# Altium project RK_NVR_DEMO1_RK3588_LP4XD200P232SD8_V21_20211228.PrjPcb (part 6 of 19)

## Sheet 21.Power-PMIC_RK806-1.SchDoc
size 594 x 420 mm; Revision: V2.1; Schematic Page Number: 11; Page Number: 21; Check: Default; Schematic Name: RK_NVR_DEMO1_RK3588_LP4/4x_V21; Page Count: 43; Page name: 21.Power-PMIC_RK806-1; Designer: Zhangdz; Schematic Page Count: 99; Revcode: V2.1; DsnPath: E:\Work\SBER\RK3588_SOM\temp\RK_NVR_DEMO1_RK3588_LP4XD200P232SD8_V21_20211228.DSN; SchematicName: RK_NVR_DEMO1_RK3588_LP4/4x_V21; PageName: 21.Power-PMIC_RK806-1; PageSize: A2; TopSchematic: True
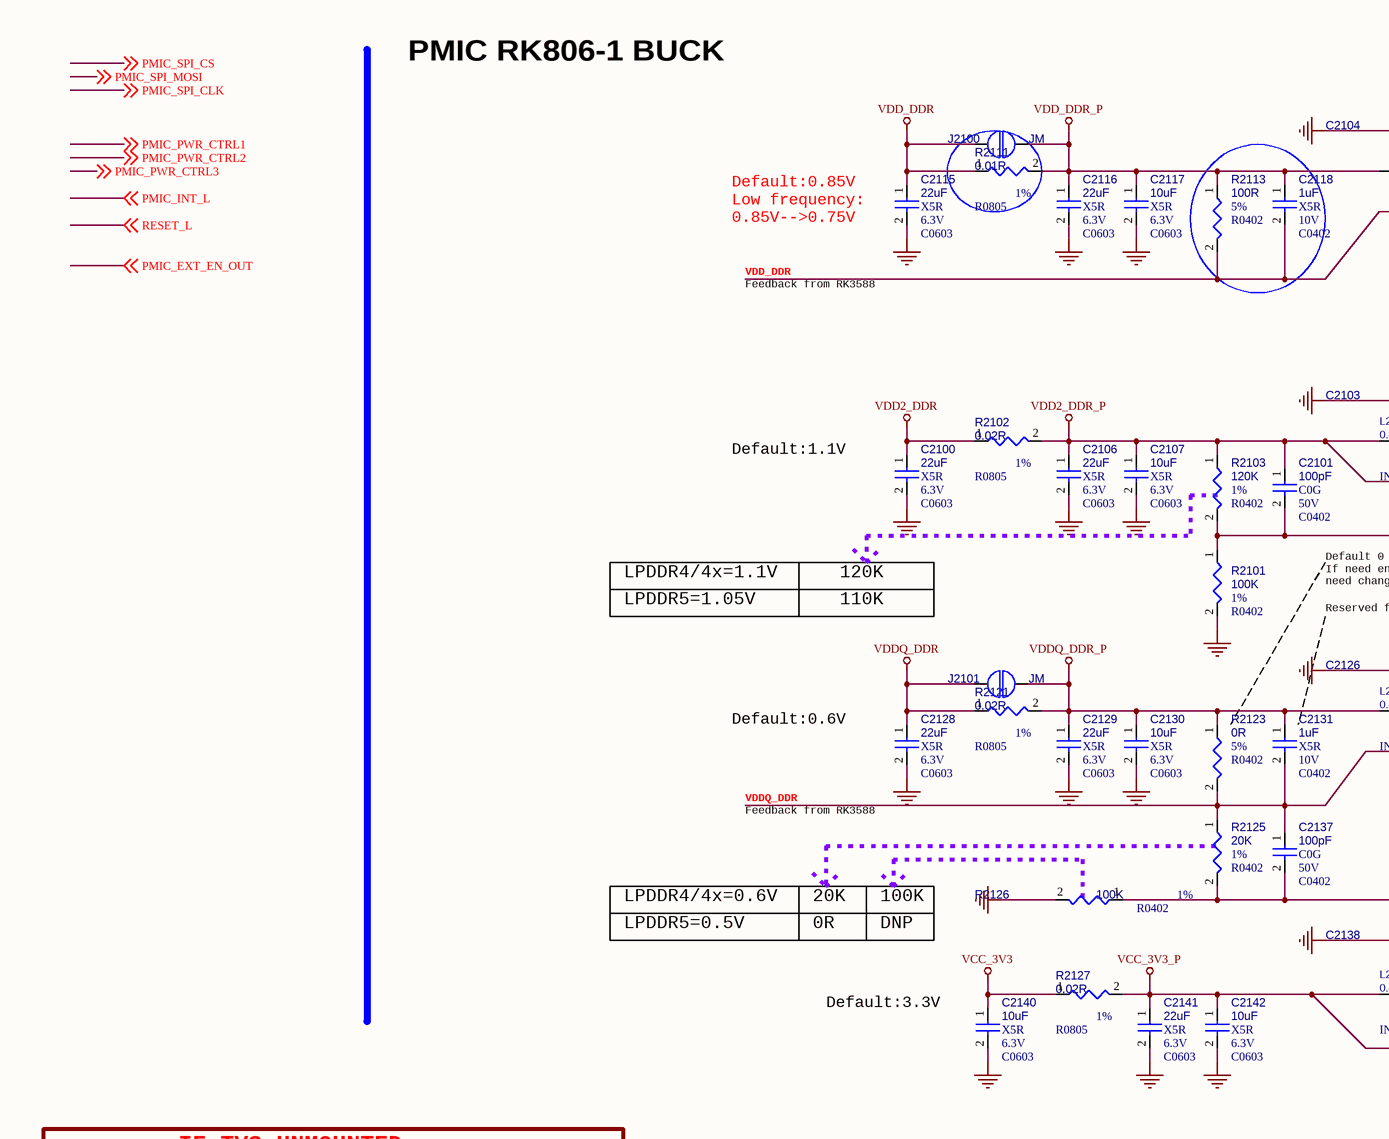
[diagram p39: 21.Power-PMIC_RK806-1.SchDoc, top left]
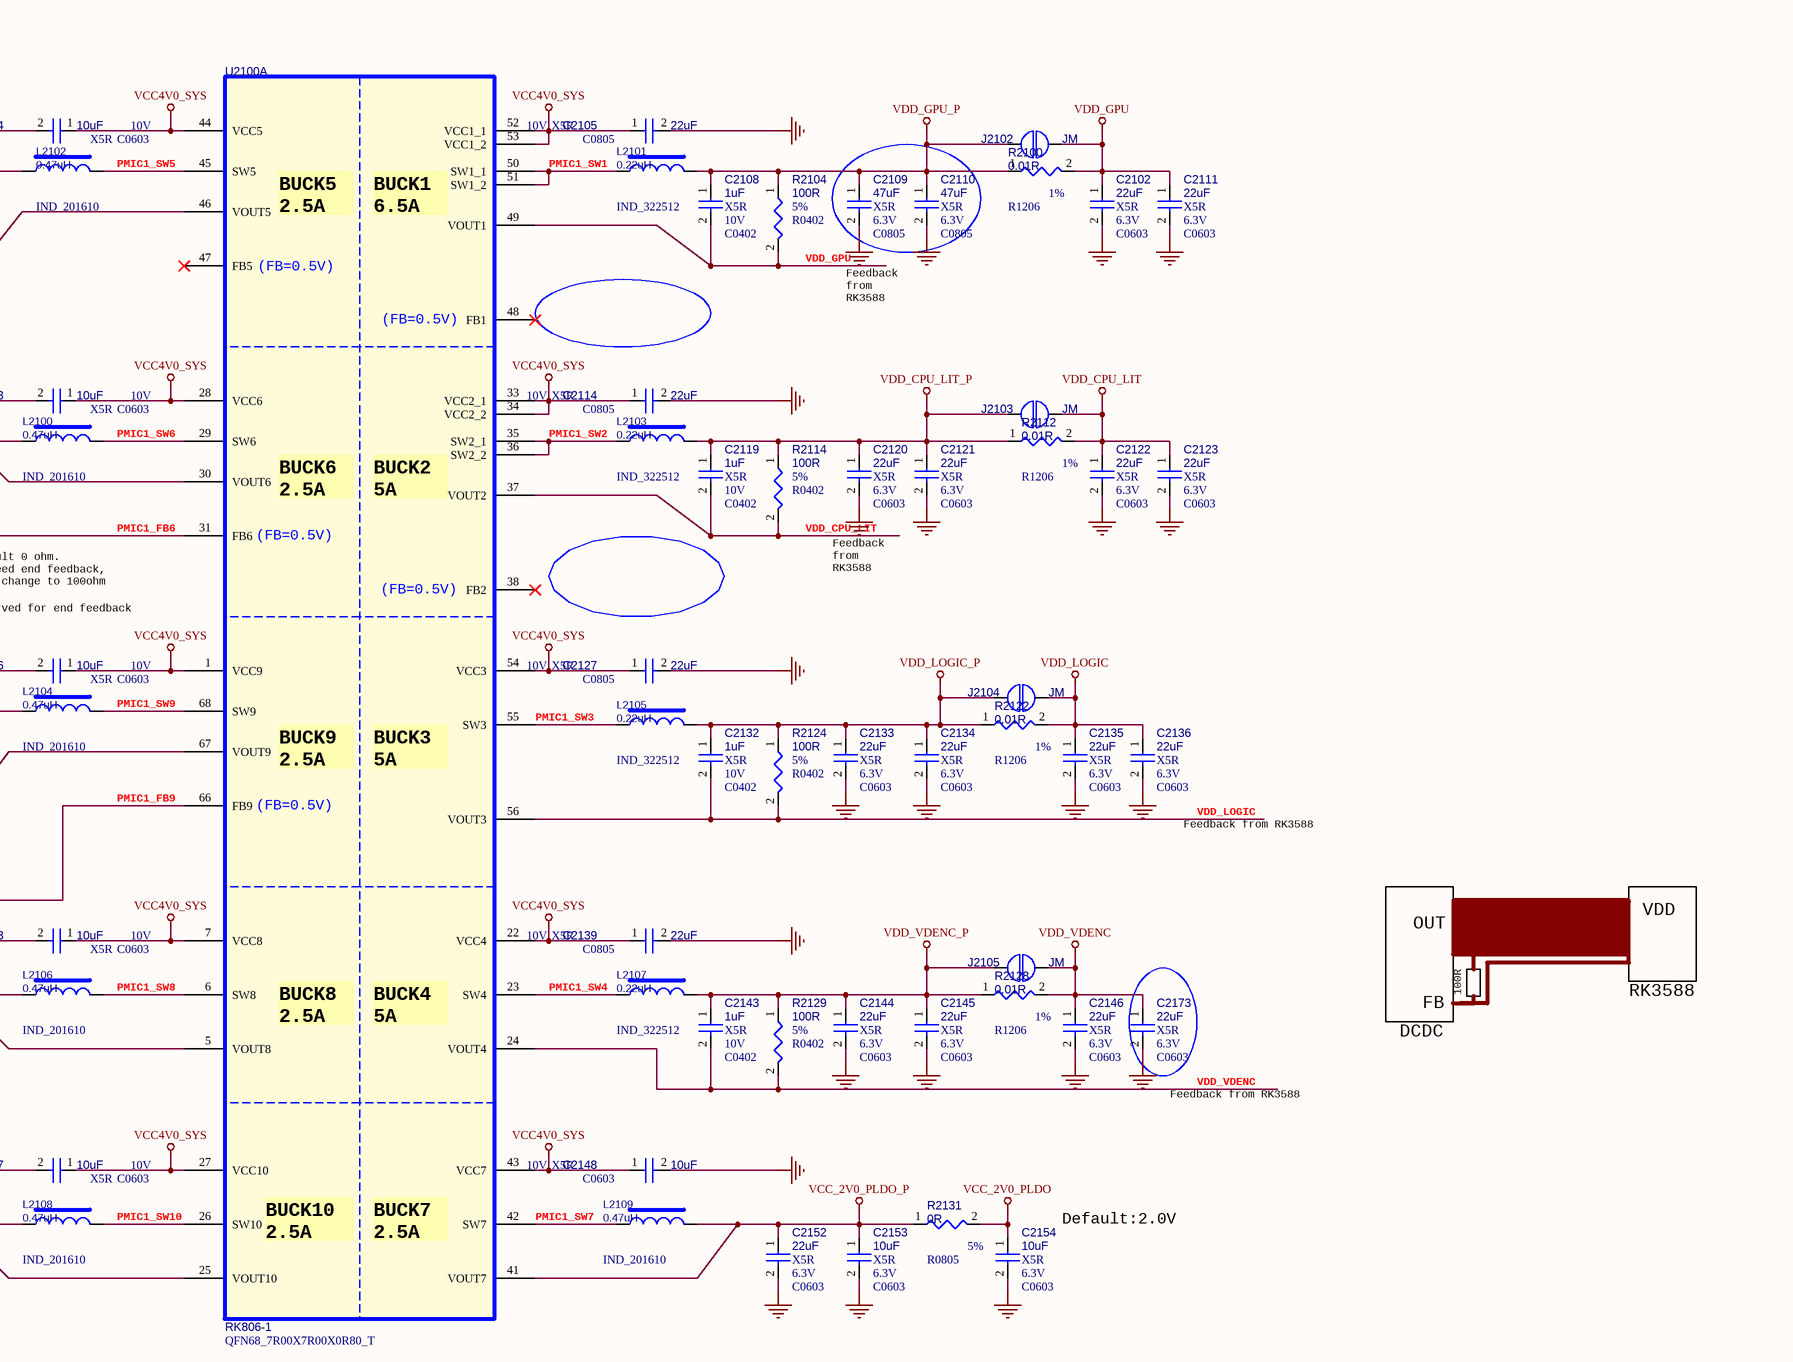
[diagram p40: 21.Power-PMIC_RK806-1.SchDoc, top right]
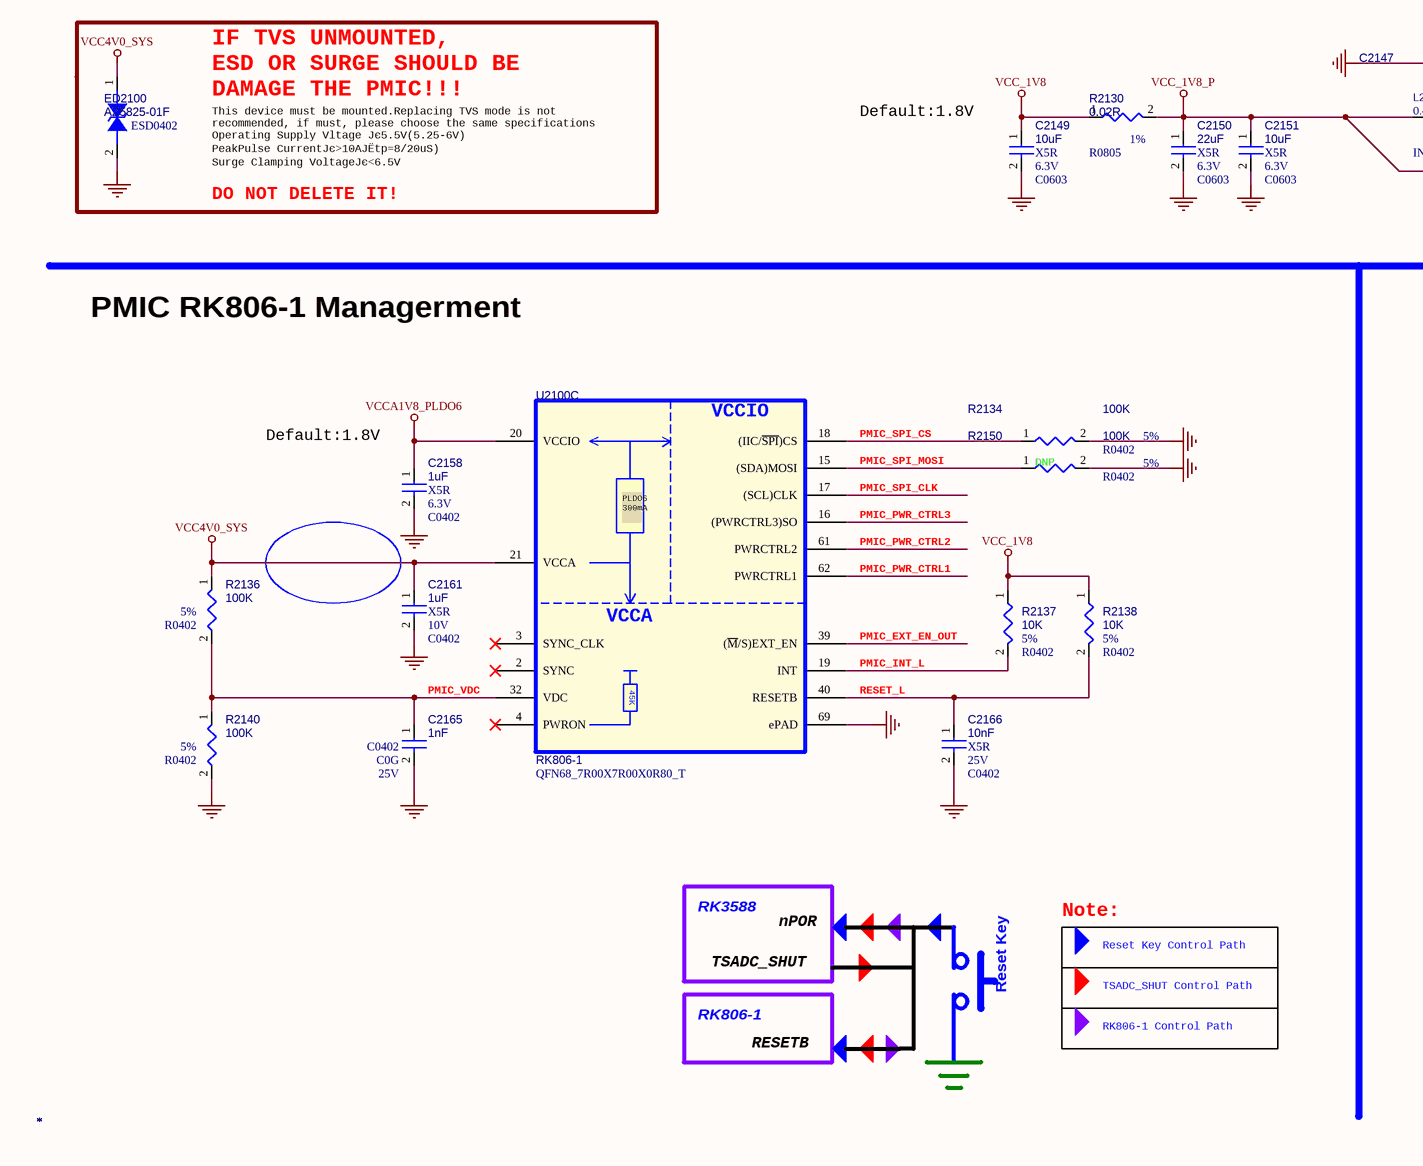
[diagram p41: 21.Power-PMIC_RK806-1.SchDoc, bottom left]
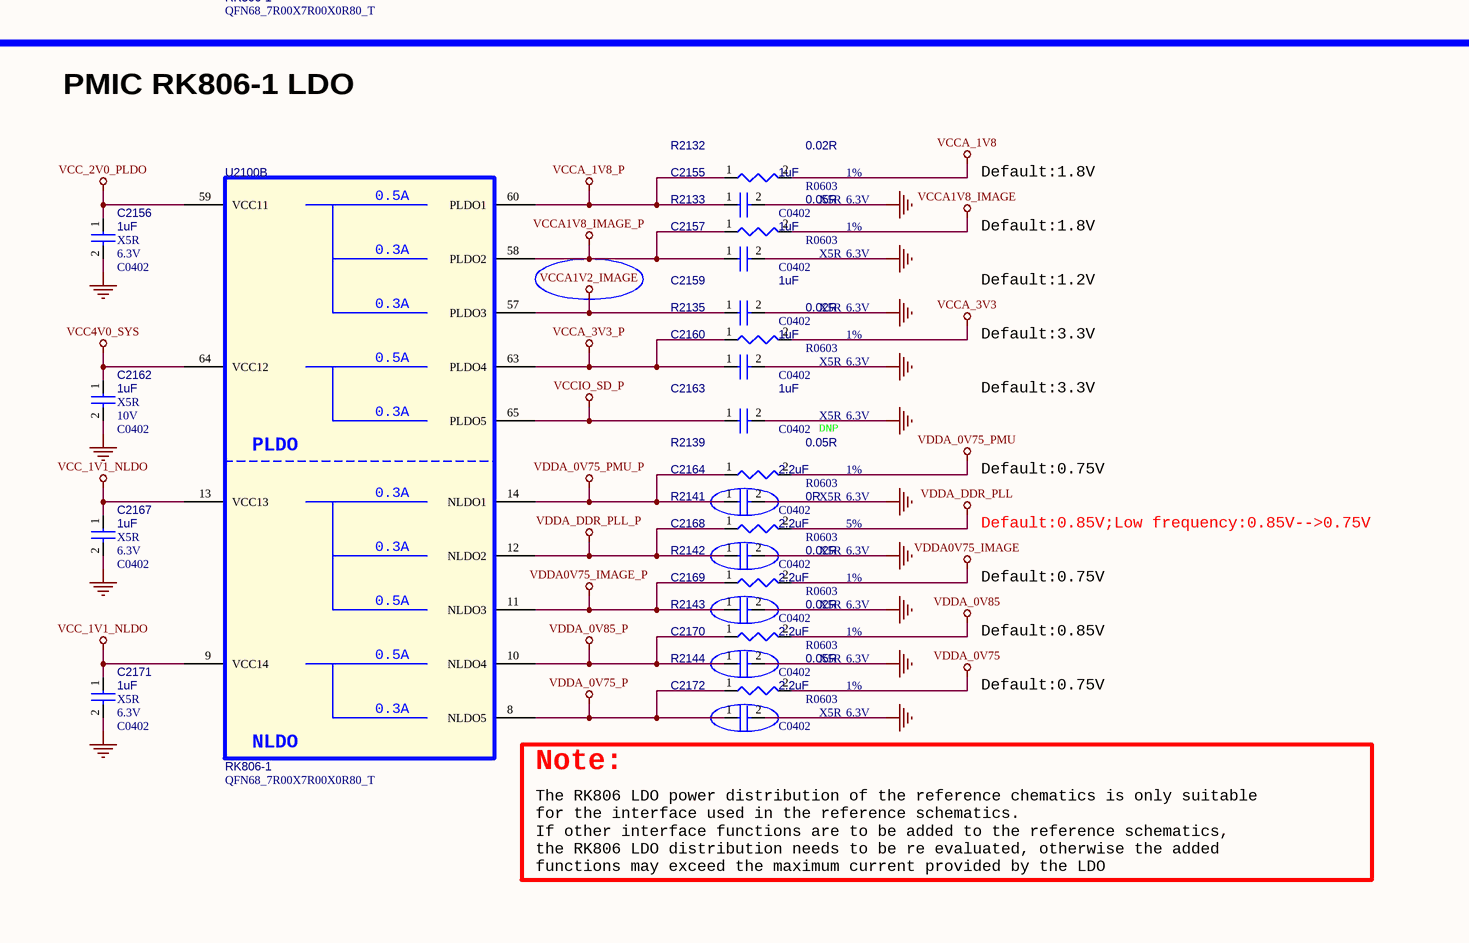
[diagram p42: 21.Power-PMIC_RK806-1.SchDoc, bottom right]

### Parts
C2100  *  Voltage: 6.3V  Dielectric: X5R  [C0603]
C2101  *  Voltage: 50V  Dielectric: C0G  [C0402]
C2102  *  Voltage: 6.3V  Dielectric: X5R  [C0603]
C2103  *  Voltage: 10V  Dielectric: X5R  [C0603]
C2104  *  Voltage: 10V  Dielectric: X5R  [C0603]
C2105  *  Voltage: 10V  Dielectric: X5R  [C0805]
C2106  *  Voltage: 6.3V  Dielectric: X5R  [C0603]
C2107  *  Voltage: 6.3V  Dielectric: X5R  [C0603]
C2108  *  Voltage: 10V  Dielectric: X5R  [C0402]
C2109  *  Voltage: 6.3V  Dielectric: X5R  [C0805]
C2110  *  Voltage: 6.3V  Dielectric: X5R  [C0805]
C2111  *  Voltage: 6.3V  Dielectric: X5R  [C0603]
C2114  *  Voltage: 10V  Dielectric: X5R  [C0805]
C2115  *  Voltage: 6.3V  Dielectric: X5R  [C0603]
C2116  *  Voltage: 6.3V  Dielectric: X5R  [C0603]
C2117  *  Voltage: 6.3V  Dielectric: X5R  [C0603]
C2118  *  Voltage: 10V  Dielectric: X5R  [C0402]
C2119  *  Voltage: 10V  Dielectric: X5R  [C0402]
C2120  *  Voltage: 6.3V  Dielectric: X5R  [C0603]
C2121  *  Voltage: 6.3V  Dielectric: X5R  [C0603]
C2122  *  Voltage: 6.3V  Dielectric: X5R  [C0603]
C2123  *  Voltage: 6.3V  Dielectric: X5R  [C0603]
C2126  *  Voltage: 10V  Dielectric: X5R  [C0603]
C2127  *  Voltage: 10V  Dielectric: X5R  [C0805]
C2128  *  Voltage: 6.3V  Dielectric: X5R  [C0603]
C2129  *  Voltage: 6.3V  Dielectric: X5R  [C0603]
C2130  *  Voltage: 6.3V  Dielectric: X5R  [C0603]
C2131  *  Voltage: 10V  Dielectric: X5R  [C0402]
C2132  *  Voltage: 10V  Dielectric: X5R  [C0402]
C2133  *  Voltage: 6.3V  Dielectric: X5R  [C0603]
C2134  *  Voltage: 6.3V  Dielectric: X5R  [C0603]
C2135  *  Voltage: 6.3V  Dielectric: X5R  [C0603]
C2136  *  Voltage: 6.3V  Dielectric: X5R  [C0603]
C2137  *  Voltage: 50V  Dielectric: C0G  [C0402]
C2138  *  Voltage: 10V  Dielectric: X5R  [C0603]
C2139  *  Voltage: 10V  Dielectric: X5R  [C0805]
C2140  *  Voltage: 6.3V  Dielectric: X5R  [C0603]
C2141  *  Voltage: 6.3V  Dielectric: X5R  [C0603]
C2142  *  Voltage: 6.3V  Dielectric: X5R  [C0603]
C2143  *  Voltage: 10V  Dielectric: X5R  [C0402]
C2144  *  Voltage: 6.3V  Dielectric: X5R  [C0603]
C2145  *  Voltage: 6.3V  Dielectric: X5R  [C0603]
C2146  *  Voltage: 6.3V  Dielectric: X5R  [C0603]
C2147  *  Voltage: 10V  Dielectric: X5R  [C0603]
C2148  *  Voltage: 10V  Dielectric: X5R  [C0603]
C2149  *  Voltage: 6.3V  Dielectric: X5R  [C0603]
C2150  *  Voltage: 6.3V  Dielectric: X5R  [C0603]
C2151  *  Voltage: 6.3V  Dielectric: X5R  [C0603]
C2152  *  Voltage: 6.3V  Dielectric: X5R  [C0603]
C2153  *  Voltage: 6.3V  Dielectric: X5R  [C0603]
C2154  *  Voltage: 6.3V  Dielectric: X5R  [C0603]
C2155  *  Voltage: 6.3V  Dielectric: X5R  [C0402]
C2156  *  Voltage: 6.3V  Dielectric: X5R  [C0402]
C2157  *  Voltage: 6.3V  Dielectric: X5R  [C0402]
C2158  *  Voltage: 6.3V  Dielectric: X5R  [C0402]
C2159  *  Voltage: 6.3V  Dielectric: X5R  [C0402]
C2160  *  Voltage: 6.3V  Dielectric: X5R  [C0402]
C2161  *  Voltage: 10V  Dielectric: X5R  [C0402]
C2162  *  Voltage: 10V  Dielectric: X5R  [C0402]
C2163  *  Voltage: 6.3V  Dielectric: X5R  option: DNP  [C0402]
C2164  *  Voltage: 6.3V  Dielectric: X5R  [C0402]
C2165  *  Voltage: 25V  Dielectric: C0G  [C0402]
C2166  *  Voltage: 25V  Dielectric: X5R  [C0402]
C2167  *  Voltage: 6.3V  Dielectric: X5R  [C0402]
C2168  *  Voltage: 6.3V  Dielectric: X5R  [C0402]
C2169  *  Voltage: 6.3V  Dielectric: X5R  [C0402]
C2170  *  Voltage: 6.3V  Dielectric: X5R  [C0402]
C2171  *  Voltage: 6.3V  Dielectric: X5R  [C0402]
C2172  *  Voltage: 6.3V  Dielectric: X5R  [C0402]
C2173  *  Voltage: 6.3V  Dielectric: X5R  [C0603]
ED2100  *  [ESD0402]
J2100  *  [OPEN]
J2101  *  [OPEN]
J2102  *  [OPEN]
J2103  *  [OPEN]
J2104  *  [OPEN]
J2105  *  [OPEN]
L2100  *  [IND_201610]
L2101  *  [IND_322512]
L2102  *  [IND_201610]
L2103  *  [IND_322512]
L2104  *  [IND_201610]
L2105  *  [IND_322512]
L2106  *  [IND_201610]
L2107  *  [IND_322512]
L2108  *  [IND_201610]
L2109  *  [IND_201610]
R2100  *  PCB Footprint: R1206  Tolerance: 1%  [R0402]
R2101  *  Tolerance: 1%  [R0402]
R2102  *  PCB Footprint: R0805  Tolerance: 1%  [R0402]
R2103  *  Tolerance: 1%  [R0402]
R2104  *  Tolerance: 5%  [R0402]
R2111  *  PCB Footprint: R0805  Tolerance: 1%  [R0402]
R2112  *  PCB Footprint: R1206  Tolerance: 1%  [R0402]
R2113  *  Tolerance: 5%  [R0402]
R2114  *  Tolerance: 5%  [R0402]
R2121  *  PCB Footprint: R0805  Tolerance: 1%  [R0402]
R2122  *  PCB Footprint: R1206  Tolerance: 1%  [R0402]
R2123  *  Tolerance: 5%  [R0402]
R2124  *  Tolerance: 5%  [R0402]
R2125  *  Tolerance: 1%  [R0402]
R2126  *  Tolerance: 1%  [R0402]
R2127  *  PCB Footprint: R0805  Tolerance: 1%  [R0402]
R2128  *  PCB Footprint: R1206  Tolerance: 1%  [R0402]
R2129  *  Tolerance: 5%  [R0402]
R2130  *  PCB Footprint: R0805  Tolerance: 1%  [R0402]
R2131  *  PCB Footprint: R0805  Tolerance: 5%  [R0402]
R2132  *  PCB Footprint: R0603  Tolerance: 1%  [R0402]
R2133  *  PCB Footprint: R0603  Tolerance: 1%  [R0402]
R2134  *  Tolerance: 5%  [R0402]
R2135  *  PCB Footprint: R0603  Tolerance: 1%  [R0402]
R2136  *  Tolerance: 5%  [R0402]
R2137  *  Tolerance: 5%  [R0402]
R2138  *  Tolerance: 5%  [R0402]
R2139  *  PCB Footprint: R0603  Tolerance: 1%  [R0402]
R2140  *  Tolerance: 5%  [R0402]
R2141  *  PCB Footprint: R0603  Tolerance: 5%  [R0402]
R2142  *  PCB Footprint: R0603  Tolerance: 1%  [R0402]
R2143  *  PCB Footprint: R0603  Tolerance: 1%  [R0402]
R2144  *  PCB Footprint: R0603  Tolerance: 1%  [R0402]
R2150  *  Tolerance: 5%  option: DNP  [R0402]
U2100  *  [QFN68_7R00X7R00X0R80_T]  (parts A,B,C of 3)

### Blocks framed on the sheet
DO NOT DELETE IT!: ED2100

### Nets
GND: C2100.2 C2102.2 C2103.2 C2104.2 C2105.2 C2106.2 C2107.2 C2109.2 C2110.2 C2111.2 C2114.2 C2115.2 C2116.2 C2117.2 C2120.2 C2121.2 C2122.2 C2123.2 C2126.2 C2127.2 C2128.2 C2129.2 C2130.2 C2133.2 C2134.2 C2135.2 C2136.2 C2138.2 C2139.2 C2140.2 C2141.2 C2142.2 C2144.2 C2145.2 C2146.2 C2147.2 C2148.2 C2149.2 C2150.2 C2151.2 C2152.2 C2153.2 C2154.2 C2155.2 C2156.2 C2157.2 C2158.2 C2159.2 C2160.2 C2161.2 C2162.2 C2163.2 C2164.2 C2165.2 C2166.2 C2167.2 C2168.2 C2169.2 C2170.2 C2171.2 C2172.2 C2173.2 ED2100.2 R2101.2 R2126.2 R2134.2 R2140.2 R2150.2 U2100.69(ePAD)
VCC4V0_SYS: C2103.1 C2104.1 C2105.1 C2114.1 C2126.1 C2127.1 C2138.1 C2139.1 C2147.1 C2148.1 C2161.1 C2162.1 ED2100.1 R2136.1 U2100.1(VCC9) U2100.7(VCC8) U2100.21(VCCA) U2100.22(VCC4) U2100.27(VCC10) U2100.28(VCC6) U2100.33(VCC2_1) U2100.34(VCC2_2) U2100.43(VCC7) U2100.44(VCC5) U2100.52(VCC1_1) U2100.53(VCC1_2) U2100.54(VCC3) U2100.64(VCC12)
VCC_1V1_NLDO: C2167.1 C2171.1 U2100.9(VCC14) U2100.13(VCC13)
VCC_1V8: C2149.1 R2130.1 R2137.1 R2138.1
VCC_1V8_P: C2150.1 C2151.1 L2108.1 R2130.2 U2100.25(VOUT10)
VCC_2V0_PLDO: C2154.1 C2156.1 R2131.2 U2100.59(VCC11)
VCC_2V0_PLDO_P: C2152.1 C2153.1 L2109.2 R2131.1 U2100.41(VOUT7)
VCC_3V3: C2140.1 R2127.1
VCC_3V3_P: C2141.1 C2142.1 L2106.1 R2127.2 U2100.5(VOUT8)
VCCA1V2_IMAGE: C2159.1 U2100.57(PLDO3)
VCCA1V8_IMAGE: R2133.2
VCCA1V8_IMAGE_P: C2157.1 R2133.1 U2100.58(PLDO2)
VCCA1V8_PLDO6: C2158.1 U2100.20(VCCIO)
VCCA_1V8: R2132.2
VCCA_1V8_P: C2155.1 R2132.1 U2100.60(PLDO1)
VCCA_3V3: R2135.2
VCCA_3V3_P: C2160.1 R2135.1 U2100.63(PLDO4)
VCCIO_SD_P: C2163.1 U2100.65(PLDO5)
VDD2_DDR: C2100.1 R2102.1
VDD2_DDR_P: C2101.1 C2106.1 C2107.1 L2100.1 R2102.2 R2103.1 U2100.30(VOUT6)
VDD_CPU_LIT: C2119.2 C2122.1 C2123.1 J2103.2 R2112.2 R2114.2 U2100.37(VOUT2)
VDD_CPU_LIT_P: C2119.1 C2120.1 C2121.1 J2103.1 L2103.2 R2112.1 R2114.1
VDD_DDR: C2115.1 C2118.2 J2100.1 R2111.1 R2113.2 U2100.46(VOUT5)
VDD_DDR_P: C2116.1 C2117.1 C2118.1 J2100.2 L2102.1 R2111.2 R2113.1
VDD_GPU: C2102.1 C2108.2 C2111.1 J2102.2 R2100.2 R2104.2 U2100.49(VOUT1)
VDD_GPU_P: C2108.1 C2109.1 C2110.1 J2102.1 L2101.2 R2100.1 R2104.1
VDD_LOGIC: C2132.2 C2135.1 C2136.1 J2104.2 R2122.2 R2124.2 U2100.56(VOUT3)
VDD_LOGIC_P: C2132.1 C2133.1 C2134.1 J2104.1 L2105.2 R2122.1 R2124.1
VDD_VDENC: C2143.2 C2146.1 C2173.1 J2105.2 R2128.2 R2129.2 U2100.24(VOUT4)
VDD_VDENC_P: C2143.1 C2144.1 C2145.1 J2105.1 L2107.2 R2128.1 R2129.1
VDDA0V75_IMAGE: R2142.2
VDDA0V75_IMAGE_P: C2169.1 R2142.1 U2100.11(NLDO3)
VDDA_0V75: R2144.2
VDDA_0V75_P: C2172.1 R2144.1 U2100.8(NLDO5)
VDDA_0V75_PMU: R2139.2
VDDA_0V75_PMU_P: C2164.1 R2139.1 U2100.14(NLDO1)
VDDA_0V85: R2143.2
VDDA_0V85_P: C2170.1 R2143.1 U2100.10(NLDO4)
VDDA_DDR_PLL: R2141.2  [project net (0.75-0.85V)]
VDDA_DDR_PLL_P: C2168.1 R2141.1 U2100.12(NLDO2)
VDDQ_DDR: C2128.1 C2131.2 C2137.1 J2101.1 R2121.1 R2123.2 R2125.1 U2100.67(VOUT9)
VDDQ_DDR_P: C2129.1 C2130.1 C2131.1 J2101.2 L2104.1 R2121.2 R2123.1
PMIC1_FB6: C2101.2 R2101.1 R2103.2 U2100.31(FB6)
PMIC1_FB9: C2137.2 R2125.2 R2126.1 U2100.66(FB9)
PMIC1_SW1: L2101.1 U2100.50(SW1_1) U2100.51(SW1_2)
PMIC1_SW2: L2103.1 U2100.35(SW2_1) U2100.36(SW2_2)
PMIC1_SW3: L2105.1 U2100.55(SW3)
PMIC1_SW4: L2107.1 U2100.23(SW4)
PMIC1_SW5: L2102.2 U2100.45(SW5)
PMIC1_SW6: L2100.2 U2100.29(SW6)
PMIC1_SW7: L2109.1 U2100.42(SW7)
PMIC1_SW8: L2106.2 U2100.6(SW8)
PMIC1_SW9: L2104.2 U2100.68(SW9)
PMIC1_SW10: L2108.2 U2100.26(SW10)
PMIC_EXT_EN_OUT: U2100.39((~{M}/S)EXT_EN) ; off-sheet PMIC_EXT_EN_OUT
PMIC_INT_L: R2137.2 U2100.19(INT) ; off-sheet PMIC_INT_L
PMIC_PWR_CTRL1: U2100.62(PWRCTRL1) ; off-sheet PMIC_PWR_CTRL1
PMIC_PWR_CTRL2: U2100.61(PWRCTRL2) ; off-sheet PMIC_PWR_CTRL2
PMIC_PWR_CTRL3: U2100.16((PWRCTRL3)SO) ; off-sheet PMIC_PWR_CTRL3
PMIC_SPI_CLK: U2100.17((SCL)CLK) ; off-sheet PMIC_SPI_CLK
PMIC_SPI_CS: R2134.1 U2100.18((IIC/~{SPI})CS) ; off-sheet PMIC_SPI_CS
PMIC_SPI_MOSI: R2150.1 U2100.15((SDA)MOSI) ; off-sheet PMIC_SPI_MOSI
PMIC_VDC: C2165.1 R2136.2 R2140.1 U2100.32(VDC)
RESET_L: C2166.1 R2138.2 U2100.40(RESETB) ; off-sheet RESET_L

Not connected (* = marked no-connect by the designer): U2100 2(SYNC)* 3(SYNC_CLK)* 4(PWRON)* 38(FB2)* 47(FB5)* 48(FB1)*

### Notes on the sheet
- PMIC RK806-1 BUCK
- (near C2115) Default:0.85V
  Low frequency:
  0.85V-->0.75V
- Feedback from RK3588
- Feedback
  from
  RK3588
- Default:1.1V
- LPDDR4/4x=1.1V
- LPDDR5=1.05V
- 110K
- 120K
- Default 0 ohm.
  If need end feedback,
  need change to 100ohm
- Reserved for end feedback
- Default:0.6V
- LPDDR4/4x=0.6V
- 20K
- 100K
- VDD
- LPDDR5=0.5V
- 0R
- DNP
- OUT
- Default:3.3V
- DCDC
- FB
- 100R
- RK3588
- Operating Supply Vltage Јє5.5V(5.25-6V)
- This device must be mounted.Replacing TVS mode is not
  recommended, if must, please choose the same specifications
- IF TVS UNMOUNTED,
  ESD OR SURGE SHOULD BE
  DAMAGE THE PMIC!!!
- Default:1.8V
- Default:2.0V
- PeakPulse CurrentЈє>10AЈЁtp=8/20uS)
- Surge Clamping VoltageЈє<6.5V
- PMIC RK806-1 Managerment
- PMIC RK806-1 LDO
- Default:1.2V
- Default:0.75V
- Default:0.85V;Low frequency:0.85V-->0.75V
- Default:0.85V
- nPOR
- Note:
- Reset Key Control Path
- RK806-1
- TSADC_SHUT
- Reset Key
- TSADC_SHUT Control Path
- (near U2100) Note:
- RESETB
- RK806-1 Control Path
- The RK806 LDO power distribution of the reference chematics is only suitable
  for the interface used in the reference schematics.
  If other interface functions are to be added to the reference schematics,
  the RK806 LDO distribution needs to be re evaluated, otherwise the added
  functions may exceed the maximum current provided by the LDO
- (in symbol PMIC_RK806, part A) BUCK5 / 2.5A; BUCK1 / 6.5A; (FB=0.5V); BUCK6 / 2.5A; BUCK2 / 5A; BUCK9 / 2.5A; BUCK3 / 5A; BUCK8 / 2.5A; BUCK4 / 5A; BUCK10 / 2.5A; BUCK7 / 2.5A
- (in symbol PMIC_RK806, part B) 0.5A; 0.3A; PLDO; NLDO
- (in symbol PMIC_RK806, part C) PLDO6 / 300mA; 45K

### Library data of the parts
C2100 = CAP NP: cap,22.00uF,+/-20%,6.3V,X5R,C0603; Part Reference: C2100; Manufacturer PN: C1608X5R0J226M080AC; Manufacturer: TDK; Value: 22uF; Tolerance: 20%; Priority: A; PCB Footprint: C0603; Created by: JJJ; C_Voltage: 6.3V; Part Type: C0603; RK PN: C1608X5R0J226M080AC
C2101 = CAP NP: cap,100.00pF,+/-10%,50V,C0G,C0402; Part Reference: C2101; Manufacturer: TDK; Value: 100pF; RK PN: C1005C0G1H101K050BA; Priority: A; Tolerance: 10%; PCB Footprint: C0402; Part Type: C0402; Manufacturer PN: C1005C0G1H101K050BA; Created by: JJJ
C2102 = CAP NP: cap,22.00uF,+/-20%,6.3V,X5R,C0603; Part Reference: C2102; Manufacturer PN: C1608X5R0J226M080AC; Manufacturer: TDK; Value: 22uF; Tolerance: 20%; Priority: A; PCB Footprint: C0603; Created by: JJJ; C_Voltage: 6.3V; Part Type: C0603; RK PN: C1608X5R0J226M080AC
C2103 = CAP NP: cap,10.00uF,+/-10%,10V,X5R,C0603; Part Reference: C2103; Manufacturer PN: C1608X5R1A106K080AC; Manufacturer: TDK; Value: 10uF; Tolerance: 10%; C_Voltage: 6.3V; Priority: A; PCB Footprint: C0603; Created by: JJJ; Part Type: C0603; RK PN: C1608X5R1A106K080AC
C2104 = CAP NP: cap,10.00uF,+/-10%,10V,X5R,C0603; Part Reference: C2104; Manufacturer PN: C1608X5R1A106K080AC; Manufacturer: TDK; Value: 10uF; Tolerance: 10%; C_Voltage: 6.3V; Priority: A; PCB Footprint: C0603; Created by: JJJ; Part Type: C0603; RK PN: C1608X5R1A106K080AC
C2105 = CAP NP: cap,22.00uF,+/-10%,10V,X5R,C0805; Part Reference: C2105; Manufacturer: TDK; Value: 22uF; RK PN: C2012X5R1A226K125AB; Priority: A; C_Voltage: 6.3V; Tolerance: 10%; PCB Footprint: C0805; Part Type: C0805; Manufacturer PN: C2012X5R1A226K125AB; Created by: JJJ
C2106 = CAP NP: cap,22.00uF,+/-20%,6.3V,X5R,C0603; Part Reference: C2106; Manufacturer PN: C1608X5R0J226M080AC; Manufacturer: TDK; Value: 22uF; Tolerance: 20%; Priority: A; PCB Footprint: C0603; Created by: JJJ; C_Voltage: 6.3V; Part Type: C0603; RK PN: C1608X5R0J226M080AC
C2107 = CAP NP: cap,10.00uF,+/-10%,6.3V,X5R,C0603; Part Reference: C2107; Manufacturer PN: C1608X5R0J106K080AB; Manufacturer: TDK; Value: 10uF; Tolerance: 10%; Priority: A; PCB Footprint: C0603; Created by: JJJ; C_Voltage: 6.3V; Part Type: C0603; RK PN: C1608X5R0J106K080AB
C2108 = CAP NP: cap,1.00uF,+/-10%,10V,X5R,C0402; Part Reference: C2108; Manufacturer: TDK; Value: 1uF; RK PN: C1005X5R1A105K050BB; Priority: A; Tolerance: 10%; PCB Footprint: C0402; Part Type: C0402; Manufacturer PN: C1005X5R1A105K050BB; Created by: JJJ
C2109 = CAP NP: cap,47.00uF,+/-20%,6.3V,X5R,C0805; Part Reference: C2109; Manufacturer: TDK; Value: 47uF; RK PN: C2012X5R0J476M125AC; Priority: A; Tolerance: 20%; PCB Footprint: C0805; Part Type: C0805; C_Voltage: 6.3V; Manufacturer PN: C2012X5R0J476M125AC; Created by: JJJ
C2110 = CAP NP: cap,47.00uF,+/-20%,6.3V,X5R,C0805; Part Reference: C2110; Manufacturer PN: C2012X5R0J476M125AC; Manufacturer: TDK; Value: 47uF; Tolerance: 20%; Priority: A; PCB Footprint: C0805; Created by: JJJ; C_Voltage: 6.3V; Part Type: C0805; RK PN: C2012X5R0J476M125AC
C2111 = CAP NP: cap,22.00uF,+/-20%,6.3V,X5R,C0603; Part Reference: C2111; Manufacturer PN: C1608X5R0J226M080AC; Manufacturer: TDK; Value: 22uF; Tolerance: 20%; Priority: A; PCB Footprint: C0603; Created by: JJJ; C_Voltage: 6.3V; Part Type: C0603; RK PN: C1608X5R0J226M080AC
C2114 = CAP NP: cap,22.00uF,+/-10%,10V,X5R,C0805; Part Reference: C2114; Manufacturer: TDK; Value: 22uF; RK PN: C2012X5R1A226K125AB; Priority: A; C_Voltage: 6.3V; Tolerance: 10%; PCB Footprint: C0805; Part Type: C0805; Manufacturer PN: C2012X5R1A226K125AB; Created by: JJJ
C2115 = CAP NP: cap,22.00uF,+/-20%,6.3V,X5R,C0603; Part Reference: C2115; Manufacturer: TDK; Value: 22uF; RK PN: C1608X5R0J226M080AC; Priority: A; Tolerance: 20%; PCB Footprint: C0603; Part Type: C0603; C_Voltage: 6.3V; Manufacturer PN: C1608X5R0J226M080AC; Created by: JJJ
C2116 = CAP NP: cap,22.00uF,+/-20%,6.3V,X5R,C0603; Part Reference: C2116; Manufacturer PN: C1608X5R0J226M080AC; Manufacturer: TDK; Value: 22uF; Tolerance: 20%; Priority: A; PCB Footprint: C0603; Created by: JJJ; C_Voltage: 6.3V; Part Type: C0603; RK PN: C1608X5R0J226M080AC
C2117 = CAP NP: cap,10.00uF,+/-10%,6.3V,X5R,C0603; Part Reference: C2117; Manufacturer PN: C1608X5R0J106K080AB; Manufacturer: TDK; Value: 10uF; Tolerance: 10%; Priority: A; PCB Footprint: C0603; Created by: JJJ; C_Voltage: 6.3V; Part Type: C0603; RK PN: C1608X5R0J106K080AB
C2118 = CAP NP: cap,1.00uF,+/-10%,10V,X5R,C0402; Part Reference: C2118; Manufacturer PN: C1005X5R1A105K050BB; Manufacturer: TDK; Value: 1uF; Tolerance: 10%; Priority: A; PCB Footprint: C0402; Created by: JJJ; Part Type: C0402; RK PN: C1005X5R1A105K050BB
C2119 = CAP NP: cap,1.00uF,+/-10%,10V,X5R,C0402; Part Reference: C2119; Manufacturer: TDK; Value: 1uF; RK PN: C1005X5R1A105K050BB; Priority: A; Tolerance: 10%; PCB Footprint: C0402; Part Type: C0402; Manufacturer PN: C1005X5R1A105K050BB; Created by: JJJ
C2120 = CAP NP: cap,22.00uF,+/-20%,6.3V,X5R,C0603; Part Reference: C2120; Manufacturer PN: C1608X5R0J226M080AC; Manufacturer: TDK; Value: 22uF; Tolerance: 20%; Priority: A; PCB Footprint: C0603; Created by: JJJ; C_Voltage: 6.3V; Part Type: C0603; RK PN: C1608X5R0J226M080AC
C2121 = CAP NP: cap,22.00uF,+/-20%,6.3V,X5R,C0603; Part Reference: C2121; Manufacturer PN: C1608X5R0J226M080AC; Manufacturer: TDK; Value: 22uF; Tolerance: 20%; Priority: A; PCB Footprint: C0603; Created by: JJJ; C_Voltage: 6.3V; Part Type: C0603; RK PN: C1608X5R0J226M080AC
C2122 = CAP NP: cap,22.00uF,+/-20%,6.3V,X5R,C0603; Part Reference: C2122; Manufacturer: TDK; Value: 22uF; RK PN: C1608X5R0J226M080AC; Priority: A; Tolerance: 20%; PCB Footprint: C0603; Part Type: C0603; C_Voltage: 6.3V; Manufacturer PN: C1608X5R0J226M080AC; Created by: JJJ
C2123 = CAP NP: cap,22.00uF,+/-20%,6.3V,X5R,C0603; Part Reference: C2123; Manufacturer: TDK; Value: 22uF; RK PN: C1608X5R0J226M080AC; Priority: A; Tolerance: 20%; PCB Footprint: C0603; Part Type: C0603; C_Voltage: 6.3V; Manufacturer PN: C1608X5R0J226M080AC; Created by: JJJ
C2126 = CAP NP: cap,10.00uF,+/-10%,10V,X5R,C0603; Part Reference: C2126; Manufacturer PN: C1608X5R1A106K080AC; Manufacturer: TDK; Value: 10uF; Tolerance: 10%; C_Voltage: 6.3V; Priority: A; PCB Footprint: C0603; Created by: JJJ; Part Type: C0603; RK PN: C1608X5R1A106K080AC
C2127 = CAP NP: cap,22.00uF,+/-10%,10V,X5R,C0805; Part Reference: C2127; Manufacturer: TDK; Value: 22uF; RK PN: C2012X5R1A226K125AB; Priority: A; C_Voltage: 6.3V; Tolerance: 10%; PCB Footprint: C0805; Part Type: C0805; Manufacturer PN: C2012X5R1A226K125AB; Created by: JJJ
C2128 = CAP NP: cap,22.00uF,+/-20%,6.3V,X5R,C0603; Part Reference: C2128; Manufacturer PN: C1608X5R0J226M080AC; Manufacturer: TDK; Value: 22uF; Tolerance: 20%; Priority: A; PCB Footprint: C0603; Created by: JJJ; C_Voltage: 6.3V; Part Type: C0603; RK PN: C1608X5R0J226M080AC
C2129 = CAP NP: cap,22.00uF,+/-20%,6.3V,X5R,C0603; Part Reference: C2129; Manufacturer PN: C1608X5R0J226M080AC; Manufacturer: TDK; Value: 22uF; Tolerance: 20%; Priority: A; PCB Footprint: C0603; Created by: JJJ; C_Voltage: 6.3V; Part Type: C0603; RK PN: C1608X5R0J226M080AC
C2130 = CAP NP: cap,10.00uF,+/-10%,6.3V,X5R,C0603; Part Reference: C2130; Manufacturer PN: C1608X5R0J106K080AB; Manufacturer: TDK; Value: 10uF; Tolerance: 10%; Priority: A; PCB Footprint: C0603; Created by: JJJ; C_Voltage: 6.3V; Part Type: C0603; RK PN: C1608X5R0J106K080AB
C2131 = CAP NP: cap,1.00uF,+/-10%,10V,X5R,C0402; Part Reference: C2131; Manufacturer PN: C1005X5R1A105K050BB; Manufacturer: TDK; Value: 1uF; Tolerance: 10%; Priority: A; PCB Footprint: C0402; Created by: JJJ; Part Type: C0402; RK PN: C1005X5R1A105K050BB
C2132 = CAP NP: cap,1.00uF,+/-10%,10V,X5R,C0402; Part Reference: C2132; Manufacturer: TDK; Value: 1uF; RK PN: C1005X5R1A105K050BB; Priority: A; Tolerance: 10%; PCB Footprint: C0402; Part Type: C0402; Manufacturer PN: C1005X5R1A105K050BB; Created by: JJJ
C2133 = CAP NP: cap,22.00uF,+/-20%,6.3V,X5R,C0603; Part Reference: C2133; Manufacturer PN: C1608X5R0J226M080AC; Manufacturer: TDK; Value: 22uF; Tolerance: 20%; Priority: A; PCB Footprint: C0603; Created by: JJJ; C_Voltage: 6.3V; Part Type: C0603; RK PN: C1608X5R0J226M080AC
C2134 = CAP NP: cap,22.00uF,+/-20%,6.3V,X5R,C0603; Part Reference: C2134; Manufacturer PN: C1608X5R0J226M080AC; Manufacturer: TDK; Value: 22uF; Tolerance: 20%; Priority: A; PCB Footprint: C0603; Created by: JJJ; C_Voltage: 6.3V; Part Type: C0603; RK PN: C1608X5R0J226M080AC
C2135 = CAP NP: cap,22.00uF,+/-20%,6.3V,X5R,C0603; Part Reference: C2135; Manufacturer PN: C1608X5R0J226M080AC; Manufacturer: TDK; Value: 22uF; Tolerance: 20%; Priority: A; PCB Footprint: C0603; Created by: JJJ; C_Voltage: 6.3V; Part Type: C0603; RK PN: C1608X5R0J226M080AC
C2136 = CAP NP: cap,22.00uF,+/-20%,6.3V,X5R,C0603; Part Reference: C2136; Manufacturer PN: C1608X5R0J226M080AC; Manufacturer: TDK; Value: 22uF; Tolerance: 20%; Priority: A; PCB Footprint: C0603; Created by: JJJ; C_Voltage: 6.3V; Part Type: C0603; RK PN: C1608X5R0J226M080AC
C2137 = CAP NP: cap,100.00pF,+/-10%,50V,C0G,C0402; Part Reference: C2137; Manufacturer: TDK; Value: 100pF; RK PN: C1005C0G1H101K050BA; Priority: A; Tolerance: 10%; PCB Footprint: C0402; Part Type: C0402; Manufacturer PN: C1005C0G1H101K050BA; Created by: JJJ
C2138 = CAP NP: cap,10.00uF,+/-10%,10V,X5R,C0603; Part Reference: C2138; Manufacturer PN: C1608X5R1A106K080AC; Manufacturer: TDK; Value: 10uF; Tolerance: 10%; C_Voltage: 6.3V; Priority: A; PCB Footprint: C0603; Created by: JJJ; Part Type: C0603; RK PN: C1608X5R1A106K080AC
C2139 = CAP NP: cap,22.00uF,+/-10%,10V,X5R,C0805; Part Reference: C2139; Manufacturer: TDK; Value: 22uF; RK PN: C2012X5R1A226K125AB; Priority: A; C_Voltage: 6.3V; Tolerance: 10%; PCB Footprint: C0805; Part Type: C0805; Manufacturer PN: C2012X5R1A226K125AB; Created by: JJJ
C2140 = CAP NP: cap,10.00uF,+/-10%,6.3V,X5R,C0603; Part Reference: C2140; Manufacturer: TDK; Value: 10uF; RK PN: C1608X5R0J106K080AB; Priority: A; Tolerance: 10%; PCB Footprint: C0603; Part Type: C0603; C_Voltage: 6.3V; Manufacturer PN: C1608X5R0J106K080AB; Created by: JJJ
C2141 = CAP NP: cap,22.00uF,+/-20%,6.3V,X5R,C0603; Part Reference: C2141; Manufacturer PN: C1608X5R0J226M080AC; Manufacturer: TDK; Value: 22uF; Tolerance: 20%; Priority: A; PCB Footprint: C0603; Created by: JJJ; C_Voltage: 6.3V; Part Type: C0603; RK PN: C1608X5R0J226M080AC
C2142 = CAP NP: cap,10.00uF,+/-10%,6.3V,X5R,C0603; Part Reference: C2142; Manufacturer PN: C1608X5R0J106K080AB; Manufacturer: TDK; Value: 10uF; Tolerance: 10%; Priority: A; PCB Footprint: C0603; Created by: JJJ; C_Voltage: 6.3V; Part Type: C0603; RK PN: C1608X5R0J106K080AB
C2143 = CAP NP: cap,1.00uF,+/-10%,10V,X5R,C0402; Part Reference: C2143; Manufacturer: TDK; Value: 1uF; RK PN: C1005X5R1A105K050BB; Priority: A; Tolerance: 10%; PCB Footprint: C0402; Part Type: C0402; Manufacturer PN: C1005X5R1A105K050BB; Created by: JJJ
C2144 = CAP NP: cap,22.00uF,+/-20%,6.3V,X5R,C0603; Part Reference: C2144; Manufacturer: TDK; Value: 22uF; RK PN: C1608X5R0J226M080AC; Priority: A; Tolerance: 20%; PCB Footprint: C0603; Part Type: C0603; C_Voltage: 6.3V; Manufacturer PN: C1608X5R0J226M080AC; Created by: JJJ
C2145 = CAP NP: cap,22.00uF,+/-20%,6.3V,X5R,C0603; Part Reference: C2145; Manufacturer: TDK; Value: 22uF; RK PN: C1608X5R0J226M080AC; Priority: A; Tolerance: 20%; PCB Footprint: C0603; Part Type: C0603; C_Voltage: 6.3V; Manufacturer PN: C1608X5R0J226M080AC; Created by: JJJ
C2146 = CAP NP: cap,22.00uF,+/-20%,6.3V,X5R,C0603; Part Reference: C2146; Manufacturer: TDK; Value: 22uF; RK PN: C1608X5R0J226M080AC; Priority: A; Tolerance: 20%; PCB Footprint: C0603; Part Type: C0603; C_Voltage: 6.3V; Manufacturer PN: C1608X5R0J226M080AC; Created by: JJJ
C2147 = CAP NP: cap,10.00uF,+/-10%,10V,X5R,C0603; Part Reference: C2147; Manufacturer: TDK; Value: 10uF; RK PN: C1608X5R1A106K080AC; Priority: A; C_Voltage: 6.3V; Tolerance: 10%; PCB Footprint: C0603; Part Type: C0603; Manufacturer PN: C1608X5R1A106K080AC; Created by: JJJ
C2148 = CAP NP: cap,10.00uF,+/-10%,10V,X5R,C0603; Part Reference: C2148; Manufacturer: TDK; Value: 10uF; RK PN: C1608X5R1A106K080AC; Priority: A; C_Voltage: 6.3V; Tolerance: 10%; PCB Footprint: C0603; Part Type: C0603; Manufacturer PN: C1608X5R1A106K080AC; Created by: JJJ
C2149 = CAP NP: cap,10.00uF,+/-10%,6.3V,X5R,C0603; Part Reference: C2149; Manufacturer: TDK; Value: 10uF; RK PN: C1608X5R0J106K080AB; Priority: A; Tolerance: 10%; PCB Footprint: C0603; Part Type: C0603; C_Voltage: 6.3V; Manufacturer PN: C1608X5R0J106K080AB; Created by: JJJ
C2150 = CAP NP: cap,22.00uF,+/-20%,6.3V,X5R,C0603; Part Reference: C2150; Manufacturer PN: C1608X5R0J226M080AC; Manufacturer: TDK; Value: 22uF; Tolerance: 20%; Priority: A; PCB Footprint: C0603; Created by: JJJ; C_Voltage: 6.3V; Part Type: C0603; RK PN: C1608X5R0J226M080AC
C2151 = CAP NP: cap,10.00uF,+/-10%,6.3V,X5R,C0603; Part Reference: C2151; Manufacturer PN: C1608X5R0J106K080AB; Manufacturer: TDK; Value: 10uF; Tolerance: 10%; Priority: A; PCB Footprint: C0603; Created by: JJJ; C_Voltage: 6.3V; Part Type: C0603; RK PN: C1608X5R0J106K080AB
C2152 = CAP NP: cap,22.00uF,+/-20%,6.3V,X5R,C0603; Part Reference: C2152; Manufacturer PN: C1608X5R0J226M080AC; Manufacturer: TDK; Value: 22uF; Tolerance: 20%; Priority: A; PCB Footprint: C0603; Created by: JJJ; C_Voltage: 6.3V; Part Type: C0603; RK PN: C1608X5R0J226M080AC
C2153 = CAP NP: cap,10.00uF,+/-10%,6.3V,X5R,C0603; Part Reference: C2153; Manufacturer PN: C1608X5R0J106K080AB; Manufacturer: TDK; Value: 10uF; Tolerance: 10%; Priority: A; PCB Footprint: C0603; Created by: JJJ; C_Voltage: 6.3V; Part Type: C0603; RK PN: C1608X5R0J106K080AB
C2154 = CAP NP: cap,10.00uF,+/-10%,6.3V,X5R,C0603; Part Reference: C2154; Manufacturer PN: C1608X5R0J106K080AB; Manufacturer: TDK; Value: 10uF; Tolerance: 10%; Priority: A; PCB Footprint: C0603; Created by: JJJ; C_Voltage: 6.3V; Part Type: C0603; RK PN: C1608X5R0J106K080AB
C2155 = CAP NP: cap,1.00uF,+/-10%,6.3V,X5R,C0402; Part Reference: C2155; Manufacturer PN: C1005X5R0J105K050BB; Manufacturer: TDK; Value: 1uF; Tolerance: 10%; Priority: A; PCB Footprint: C0402; Created by: JJJ; C_Voltage: 6.3V; Part Type: C0402; RK PN: C1005X5R0J105K050BB
C2156 = CAP NP: cap,1.00uF,+/-10%,6.3V,X5R,C0402; Part Reference: C2156; Manufacturer: TDK; Value: 1uF; RK PN: C1005X5R0J105K050BB; Priority: A; Tolerance: 10%; PCB Footprint: C0402; Part Type: C0402; C_Voltage: 6.3V; Manufacturer PN: C1005X5R0J105K050BB; Created by: JJJ
C2157 = CAP NP: cap,1.00uF,+/-10%,6.3V,X5R,C0402; Part Reference: C2157; Manufacturer: TDK; Value: 1uF; RK PN: C1005X5R0J105K050BB; Priority: A; Tolerance: 10%; PCB Footprint: C0402; Part Type: C0402; C_Voltage: 6.3V; Manufacturer PN: C1005X5R0J105K050BB; Created by: JJJ
C2158 = CAP NP: cap,1.00uF,+/-10%,6.3V,X5R,C0402; Part Reference: C2158; Manufacturer: TDK; Value: 1uF; RK PN: C1005X5R0J105K050BB; Priority: A; Tolerance: 10%; PCB Footprint: C0402; Part Type: C0402; C_Voltage: 6.3V; Manufacturer PN: C1005X5R0J105K050BB; Created by: JJJ
C2159 = CAP NP: cap,1.00uF,+/-10%,6.3V,X5R,C0402; Part Reference: C2159; Manufacturer PN: C1005X5R0J105K050BB; Manufacturer: TDK; Value: 1uF; Tolerance: 10%; Priority: A; PCB Footprint: C0402; Created by: JJJ; C_Voltage: 6.3V; Part Type: C0402; RK PN: C1005X5R0J105K050BB
C2160 = CAP NP: cap,1.00uF,+/-10%,6.3V,X5R,C0402; Part Reference: C2160; Manufacturer: TDK; Value: 1uF; RK PN: C1005X5R0J105K050BB; Priority: A; Tolerance: 10%; PCB Footprint: C0402; Part Type: C0402; C_Voltage: 6.3V; Manufacturer PN: C1005X5R0J105K050BB; Created by: JJJ
C2161 = CAP NP: cap,1.00uF,+/-10%,10V,X5R,C0402; Part Reference: C2161; Manufacturer: TDK; Value: 1uF; RK PN: C1005X5R1A105K050BB; Priority: A; C_Voltage: 6.3V; Tolerance: 10%; PCB Footprint: C0402; Part Type: C0402; Manufacturer PN: C1005X5R1A105K050BB; Created by: JJJ
C2162 = CAP NP: cap,1.00uF,+/-10%,10V,X5R,C0402; Part Reference: C2162; Manufacturer: TDK; Value: 1uF; RK PN: C1005X5R1A105K050BB; Priority: A; C_Voltage: 6.3V; Tolerance: 10%; PCB Footprint: C0402; Part Type: C0402; Manufacturer PN: C1005X5R1A105K050BB; Created by: JJJ
C2163 = CAP NP: cap,1.00uF,+/-10%,6.3V,X5R,C0402; Part Reference: C2163; Manufacturer PN: C1005X5R0J105K050BB; Manufacturer: TDK; Value: 1uF; Tolerance: 10%; Priority: A; PCB Footprint: C0402; Created by: JJJ; C_Voltage: 6.3V; Part Type: C0402; RK PN: C1005X5R0J105K050BB
C2164 = CAP NP: cap,2.20uF,+/-10%,6.3V,X5R,C0402; Part Reference: C2164; Manufacturer: TDK; Value: 2.2uF; RK PN: C1005X5R0J225K050BC; Priority: A; Tolerance: 10%; PCB Footprint: C0402; Part Type: C0402; C_Voltage: 6.3V; Manufacturer PN: C1005X5R0J225K050BC; Created by: JJJ
C2165 = CAP NP: cap,1.00nF,+/-5%,25V,C0G,C0402; Part Reference: C2165; Manufacturer: TDK; Value: 1nF; RK PN: C1005C0G1E102J050BA; Priority: A; Tolerance: 5%; PCB Footprint: C0402; Part Type: C0402; Manufacturer PN: C1005C0G1E102J050BA; Created by: JJJ
C2166 = CAP NP: cap,10.00nF,+/-10%,25V,X5R,C0402; Part Reference: C2166; Manufacturer: TDK; Value: 10nF; RK PN: C1005X5R1E103K050BA; Priority: A; C_Voltage: 6.3V; Tolerance: 10%; PCB Footprint: C0402; Part Type: C0402; Manufacturer PN: C1005X5R1E103K050BA; Created by: JJJ
C2167 = CAP NP: cap,1.00uF,+/-10%,6.3V,X5R,C0402; Part Reference: C2167; Manufacturer: TDK; Value: 1uF; RK PN: C1005X5R0J105K050BB; Priority: A; Tolerance: 10%; PCB Footprint: C0402; Part Type: C0402; C_Voltage: 6.3V; Manufacturer PN: C1005X5R0J105K050BB; Created by: JJJ
C2168 = CAP NP: cap,2.20uF,+/-10%,6.3V,X5R,C0402; Part Reference: C2168; Manufacturer: TDK; Value: 2.2uF; RK PN: C1005X5R0J225K050BC; Priority: A; Tolerance: 10%; PCB Footprint: C0402; Part Type: C0402; C_Voltage: 6.3V; Manufacturer PN: C1005X5R0J225K050BC; Created by: JJJ
C2169 = CAP NP: cap,2.20uF,+/-10%,6.3V,X5R,C0402; Part Reference: C2169; Manufacturer: TDK; Value: 2.2uF; RK PN: C1005X5R0J225K050BC; Priority: A; Tolerance: 10%; PCB Footprint: C0402; Part Type: C0402; C_Voltage: 6.3V; Manufacturer PN: C1005X5R0J225K050BC; Created by: JJJ
C2170 = CAP NP: cap,2.20uF,+/-10%,6.3V,X5R,C0402; Part Reference: C2170; Manufacturer: TDK; Value: 2.2uF; RK PN: C1005X5R0J225K050BC; Priority: A; Tolerance: 10%; PCB Footprint: C0402; Part Type: C0402; C_Voltage: 6.3V; Manufacturer PN: C1005X5R0J225K050BC; Created by: JJJ
C2171 = CAP NP: cap,1.00uF,+/-10%,6.3V,X5R,C0402; Part Reference: C2171; Manufacturer: TDK; Value: 1uF; RK PN: C1005X5R0J105K050BB; Priority: A; Tolerance: 10%; PCB Footprint: C0402; Part Type: C0402; C_Voltage: 6.3V; Manufacturer PN: C1005X5R0J105K050BB; Created by: JJJ
C2172 = CAP NP: cap,2.20uF,+/-10%,6.3V,X5R,C0402; Part Reference: C2172; Manufacturer: TDK; Value: 2.2uF; RK PN: C1005X5R0J225K050BC; Priority: A; Tolerance: 10%; PCB Footprint: C0402; Part Type: C0402; C_Voltage: 6.3V; Manufacturer PN: C1005X5R0J225K050BC; Created by: JJJ
C2173 = CAP NP: cap,22.00uF,+/-20%,6.3V,X5R,C0603; Part Reference: C2173; Manufacturer PN: C1608X5R0J226M080AC; Manufacturer: TDK; Value: 22uF; Tolerance: 20%; Priority: A; PCB Footprint: C0603; Created by: JJJ; C_Voltage: 6.3V; Part Type: C0603; RK PN: C1608X5R0J226M080AC
ED2100 = DIODE BI_DIR TRIG: Transient Voltage Suppressing Device.Tiny Packge for ESD/Transient Protection; Part Reference: ED2100; Manufacturer: AmazingЈЁѕ§мНїЖјјЈ©; Value: AZ5825-01F; Priority: A; PCB Footprint: ESD0402; Created by: JJJ; Manufacturer PN: AZ5825-01F; Part Type: ESD_TVS; RK PN: AZ5825-01F
J2100 = JM_0: Part Reference: J2100; Value: JM; PCB Footprint: OPEN
J2101 = JM_0: Part Reference: J2101; Value: JM; PCB Footprint: OPEN
J2102 = JM_0: Part Reference: J2102; Value: JM; PCB Footprint: OPEN
J2103 = JM_0: Part Reference: J2103; Value: JM; PCB Footprint: OPEN
J2104 = JM_0: Part Reference: J2104; Value: JM; PCB Footprint: OPEN
J2105 = JM_0: Part Reference: J2105; Value: JM; PCB Footprint: OPEN
L2100 = INDUCTORS OF FERRITE: Power Inductor,0.47uH,20%,IND_201610; Part Reference: L2100; Manufacturer PN: WIP201610P-R47ML; Manufacturer: INPAQ; Isat: 4.4A; DC Resistor: 33mohm; Resonace frequency: 1MHz; Irms: 3.3A; Tolerance: 0.2; Priority: A; PCB Footprint: IND_201610; Value: 0.47uH; Created by: JJJ; Part Type: POWER_IND; RK PN: WIP201610P-R47ML
L2101 = INDUCTORS OF FERRITE: Power Inductor,0.22uH,20%,IND_322512; Part Reference: L2101; Manufacturer: TDK; Isat: 10A; DC Resistor: 6ohm; RK PN: TMS322512ALM-R22MTAA; Priority: A; Tolerance: 0.2; Resonace frequency: 1MHz; PCB Footprint: IND_322512; Value: 0.22uH; Part Type: POWER_IND; Manufacturer PN: TMS322512ALM-R22MTAA; Created by: YWQ
L2102 = INDUCTORS OF FERRITE: Power Inductor,0.47uH,20%,IND_201610; Part Reference: L2102; Manufacturer PN: WIP201610P-R47ML; Manufacturer: INPAQ; Isat: 4.4A; DC Resistor: 33mohm; Resonace frequency: 1MHz; Irms: 3.3A; Tolerance: 0.2; Priority: A; PCB Footprint: IND_201610; Value: 0.47uH; Created by: JJJ; Part Type: POWER_IND; RK PN: WIP201610P-R47ML
L2103 = INDUCTORS OF FERRITE: Power Inductor,0.22uH,20%,IND_322512; Part Reference: L2103; Manufacturer PN: TMS322512ALM-R22MTAA; Manufacturer: TDK; Isat: 10A; DC Resistor: 6ohm; Resonace frequency: 1MHz; Tolerance: 0.2; Priority: A; PCB Footprint: IND_322512; Value: 0.22uH; Created by: YWQ; Part Type: POWER_IND; RK PN: TMS322512ALM-R22MTAA
L2104 = INDUCTORS OF FERRITE: Power Inductor,0.47uH,20%,IND_201610; Part Reference: L2104; Manufacturer: INPAQ; Isat: 4.4A; DC Resistor: 33mohm; RK PN: WIP201610P-R47ML; Priority: A; Tolerance: 0.2; Irms: 3.3A; Resonace frequency: 1MHz; PCB Footprint: IND_201610; Value: 0.47uH; Part Type: POWER_IND; Manufacturer PN: WIP201610P-R47ML; Created by: JJJ
L2105 = INDUCTORS OF FERRITE: Power Inductor,0.22uH,20%,IND_322512; Part Reference: L2105; Manufacturer PN: TMS322512ALM-R22MTAA; Manufacturer: TDK; Isat: 10A; DC Resistor: 6ohm; Resonace frequency: 1MHz; Tolerance: 0.2; Priority: A; PCB Footprint: IND_322512; Value: 0.22uH; Created by: YWQ; Part Type: POWER_IND; RK PN: TMS322512ALM-R22MTAA
L2106 = INDUCTORS OF FERRITE: Power Inductor,0.47uH,20%,IND_201610; Part Reference: L2106; Manufacturer: INPAQ; Isat: 4.4A; DC Resistor: 33mohm; RK PN: WIP201610P-R47ML; Priority: A; Tolerance: 0.2; Irms: 3.3A; Resonace frequency: 1MHz; PCB Footprint: IND_201610; Value: 0.47uH; Part Type: POWER_IND; Manufacturer PN: WIP201610P-R47ML; Created by: JJJ
L2107 = INDUCTORS OF FERRITE: Power Inductor,0.22uH,20%,IND_322512; Part Reference: L2107; Manufacturer: TDK; Isat: 10A; DC Resistor: 6ohm; RK PN: TMS322512ALM-R22MTAA; Priority: A; Tolerance: 0.2; Resonace frequency: 1MHz; PCB Footprint: IND_322512; Value: 0.22uH; Part Type: POWER_IND; Manufacturer PN: TMS322512ALM-R22MTAA; Created by: YWQ
L2108 = INDUCTORS OF FERRITE: Power Inductor,0.47uH,20%,IND_201610; Part Reference: L2108; Manufacturer PN: WIP201610P-R47ML; Manufacturer: INPAQ; Isat: 4.4A; DC Resistor: 33mohm; Resonace frequency: 1MHz; Irms: 3.3A; Tolerance: 0.2; Priority: A; PCB Footprint: IND_201610; Value: 0.47uH; Created by: JJJ; Part Type: POWER_IND; RK PN: WIP201610P-R47ML
L2109 = INDUCTORS OF FERRITE: Power Inductor,0.47uH,20%,IND_201610; Part Reference: L2109; Manufacturer PN: WIP201610P-R47ML; Manufacturer: INPAQ; Isat: 4.4A; DC Resistor: 33mohm; Resonace frequency: 1MHz; Irms: 3.3A; Tolerance: 0.2; Priority: A; PCB Footprint: IND_201610; Value: 0.47uH; Created by: JJJ; Part Type: POWER_IND; RK PN: WIP201610P-R47ML
R2100 = RESISTOR_Dup1: µзБчјмІвµзЧи,0R01,+/-1%,R1206,1/2W,T.R.C.=ЎА75 ppm/ЎгC; Part Reference: R2100; Manufacturer: YAGEO; Value: 0.01R; RK PN: PF1206FKM7W0R012Z; Priority: A; Part Type: µзБчјмІвµзЧи; Wattage: 1/2W; Manufacturer PN: PF1206FKM7W0R012Z; Created by: YTL
R2101 = RESISTOR: НЁУГєсД¤µзЧи,100K,+/-1%,R0402,1/16W.; Part Reference: R2101; Manufacturer PN: RC0402FR-07100KL; Manufacturer: YAGEO; Wattage: 1/16W; Priority: A; PCB Footprint: R0402; Value: 100K; Created by: YTL; Part Type: НЁУГєсД¤µзЧи; RK PN: RC0402FR-07100KL
R2102 = RESISTOR_Dup1: єсД¤µНЧиЦµµзЧи,0R02,+/-1%,R0805,1/4W.; Part Reference: R2102; Manufacturer: YAGEO; Value: 0.02R; RK PN: RL0805FR-7W0R022L; Priority: A; Wattage: 1/4W; Part Type: єсД¤µНЧиЦµµзЧи; Manufacturer PN: RL0805FR-7W0R022L; Created by: YTL
R2103 = RESISTOR: НЁУГєсД¤µзЧи,120K,+/-1%,R0402,1/16W.; Part Reference: R2103; Manufacturer: YAGEO; RK PN: RC0402FR-07120KL; Priority: A; Wattage: 1/16W; PCB Footprint: R0402; Value: 120K; Part Type: НЁУГєсД¤µзЧи; Manufacturer PN: RC0402FR-07120KL; Created by: YTL
R2104 = RESISTOR_Dup1: НЁУГєсД¤µзЧи,100R,+/-5%,R0402,1/16W.; Part Reference: R2104; Manufacturer: YAGEO; RK PN: RC0402JR-07100RL; Priority: A; Wattage: 1/16W; PCB Footprint: R0402; Value: 100R; Part Type: НЁУГєсД¤µзЧи; Manufacturer PN: RC0402JR-07100RL; Created by: YTL
R2111 = RESISTOR_Dup1: єсД¤µНЧиЦµµзЧи,0R01,+/-1%,R0805,1/4W.; Part Reference: R2111; Manufacturer: YAGEO; Value: 0.01R; RK PN: RL0805FR-7W0R01L; Priority: A; Wattage: 1/4W; Part Type: єсД¤µНЧиЦµµзЧи; Manufacturer PN: RL0805FR-7W0R01L; Created by: YTL
R2112 = RESISTOR_Dup1: µзБчјмІвµзЧи,0R01,+/-1%,R1206,1/2W,T.R.C.=ЎА75 ppm/ЎгC; Part Reference: R2112; Manufacturer PN: PF1206FKM7W0R012Z; Manufacturer: YAGEO; Value: 0.01R; Priority: A; Created by: YTL; Wattage: 1/2W; Part Type: µзБчјмІвµзЧи; RK PN: PF1206FKM7W0R012Z
R2113 = RESISTOR_Dup1: НЁУГєсД¤µзЧи,100R,+/-5%,R0402,1/16W.; Part Reference: R2113; Manufacturer: YAGEO; RK PN: RC0402JR-07100RL; Priority: A; Wattage: 1/16W; PCB Footprint: R0402; Value: 100R; Part Type: НЁУГєсД¤µзЧи; Manufacturer PN: RC0402JR-07100RL; Created by: YTL
R2114 = RESISTOR_Dup1: НЁУГєсД¤µзЧи,100R,+/-5%,R0402,1/16W.; Part Reference: R2114; Manufacturer PN: RC0402JR-07100RL; Manufacturer: YAGEO; Wattage: 1/16W; Priority: A; PCB Footprint: R0402; Value: 100R; Created by: YTL; Part Type: НЁУГєсД¤µзЧи; RK PN: RC0402JR-07100RL
R2121 = RESISTOR_Dup1: єсД¤µНЧиЦµµзЧи,0R02,+/-1%,R0805,1/4W.; Part Reference: R2121; Manufacturer: YAGEO; Value: 0.02R; RK PN: RL0805FR-7W0R022L; Priority: A; Wattage: 1/4W; Part Type: єсД¤µНЧиЦµµзЧи; Manufacturer PN: RL0805FR-7W0R022L; Created by: YTL
R2122 = RESISTOR_Dup1: µзБчјмІвµзЧи,0R01,+/-1%,R1206,1/2W,T.R.C.=ЎА75 ppm/ЎгC; Part Reference: R2122; Manufacturer PN: PF1206FKM7W0R012Z; Manufacturer: YAGEO; Value: 0.01R; Priority: A; Created by: YTL; Wattage: 1/2W; Part Type: µзБчјмІвµзЧи; RK PN: PF1206FKM7W0R012Z
R2123 = RESISTOR_Dup1: НЁУГєсД¤µзЧи,0R,+/-5%,R0402,1/16W.; Part Reference: R2123; Manufacturer: YAGEO; RK PN: RC0402JR-070RL; Priority: A; Wattage: 1/16W; PCB Footprint: R0402; Value: 0R; Part Type: НЁУГєсД¤µзЧи; Manufacturer PN: RC0402JR-070RL; Created by: YTL
R2124 = RESISTOR_Dup1: НЁУГєсД¤µзЧи,100R,+/-5%,R0402,1/16W.; Part Reference: R2124; Manufacturer: YAGEO; RK PN: RC0402JR-07100RL; Priority: A; Wattage: 1/16W; PCB Footprint: R0402; Value: 100R; Part Type: НЁУГєсД¤µзЧи; Manufacturer PN: RC0402JR-07100RL; Created by: YTL
R2125 = RESISTOR: НЁУГєсД¤µзЧи,20K,+/-1%,R0402,1/16W.; Part Reference: R2125; Manufacturer PN: RC0402FR-0720KL; Manufacturer: YAGEO; Wattage: 1/16W; Priority: A; PCB Footprint: R0402; Value: 20K; Created by: YTL; Part Type: НЁУГєсД¤µзЧи; RK PN: RC0402FR-0720KL
R2126 = RESISTOR: НЁУГєсД¤µзЧи,100K,+/-1%,R0402,1/16W.; Part Reference: R2126; Manufacturer: YAGEO; RK PN: RC0402FR-07100KL; Priority: A; Wattage: 1/16W; PCB Footprint: R0402; Value: 100K; Part Type: НЁУГєсД¤µзЧи; Manufacturer PN: RC0402FR-07100KL; Created by: YTL
R2127 = RESISTOR_Dup1: єсД¤µНЧиЦµµзЧи,0R02,+/-1%,R0805,1/4W.; Part Reference: R2127; Manufacturer: YAGEO; Value: 0.02R; RK PN: RL0805FR-7W0R022L; Priority: A; Wattage: 1/4W; Part Type: єсД¤µНЧиЦµµзЧи; Manufacturer PN: RL0805FR-7W0R022L; Created by: YTL
R2128 = RESISTOR_Dup1: µзБчјмІвµзЧи,0R01,+/-1%,R1206,1/2W,T.R.C.=ЎА75 ppm/ЎгC; Part Reference: R2128; Manufacturer: YAGEO; Value: 0.01R; RK PN: PF1206FKM7W0R012Z; Priority: A; Part Type: µзБчјмІвµзЧи; Wattage: 1/2W; Manufacturer PN: PF1206FKM7W0R012Z; Created by: YTL
R2129 = RESISTOR_Dup1: НЁУГєсД¤µзЧи,100R,+/-5%,R0402,1/16W.; Part Reference: R2129; Manufacturer: YAGEO; RK PN: RC0402JR-07100RL; Priority: A; Wattage: 1/16W; PCB Footprint: R0402; Value: 100R; Part Type: НЁУГєсД¤µзЧи; Manufacturer PN: RC0402JR-07100RL; Created by: YTL
R2130 = RESISTOR_Dup1: єсД¤µНЧиЦµµзЧи,0R02,+/-1%,R0805,1/4W.; Part Reference: R2130; Manufacturer: YAGEO; Value: 0.02R; RK PN: RL0805FR-7W0R022L; Priority: A; Wattage: 1/4W; Part Type: єсД¤µНЧиЦµµзЧи; Manufacturer PN: RL0805FR-7W0R022L; Created by: YTL
R2131 = RESISTOR_Dup1: НЁУГєсД¤µзЧи,0R,+/-5%,R0805,1/8W.; Part Reference: R2131; Manufacturer PN: RC0805JR-070RL; Manufacturer: YAGEO; Wattage: 1/8W; Priority: A; Value: 0R; Created by: YTL; Part Type: НЁУГєсД¤µзЧи; RK PN: RC0805JR-070RL
R2132 = RESISTOR_Dup1: єсД¤µНЧиЦµµзЧи,0R02,+/-1%,R0603,1/10W.; Part Reference: R2132; Manufacturer PN: RL0603FR-070R022L; Manufacturer: YAGEO; Value: 0.02R; Wattage: 1/10W; Priority: A; Created by: YTL; Part Type: єсД¤µНЧиЦµµзЧи; RK PN: RL0603FR-070R022L
R2133 = RESISTOR_Dup1: єсД¤µНЧиЦµµзЧи,0R05,+/-1%,R0603,1/10W.; Part Reference: R2133; Manufacturer PN: RL0603FR-070R05L; Manufacturer: YAGEO; Value: 0.05R; Wattage: 1/10W; Priority: A; Created by: YTL; Part Type: єсД¤µНЧиЦµµзЧи; RK PN: RL0603FR-070R05L
R2134 = RESISTOR: НЁУГєсД¤µзЧи,100K,+/-5%,R0402,1/16W.; Part Reference: R2134; Manufacturer PN: RC0402JR-07100KL; Manufacturer: YAGEO; Wattage: 1/16W; Priority: A; PCB Footprint: R0402; Value: 100K; Created by: YTL; Part Type: НЁУГєсД¤µзЧи; RK PN: RC0402JR-07100KL
R2135 = RESISTOR_Dup1: єсД¤µНЧиЦµµзЧи,0R02,+/-1%,R0603,1/10W.; Part Reference: R2135; Manufacturer PN: RL0603FR-070R022L; Manufacturer: YAGEO; Value: 0.02R; Wattage: 1/10W; Priority: A; Created by: YTL; Part Type: єсД¤µНЧиЦµµзЧи; RK PN: RL0603FR-070R022L
R2136 = RESISTOR_Dup1: НЁУГєсД¤µзЧи,100K,+/-5%,R0402,1/16W.; Part Reference: R2136; Manufacturer: YAGEO; RK PN: RC0402JR-07100KL; Priority: A; Wattage: 1/16W; PCB Footprint: R0402; Value: 100K; Part Type: НЁУГєсД¤µзЧи; Manufacturer PN: RC0402JR-07100KL; Created by: YTL
R2137 = RESISTOR: НЁУГєсД¤µзЧи,10K,+/-5%,R0402,1/16W.; Part Reference: R2137; Manufacturer PN: RC0402JR-0710KL; Manufacturer: YAGEO; Wattage: 1/16W; Priority: A; PCB Footprint: R0402; Value: 10K; Created by: YTL; Part Type: НЁУГєсД¤µзЧи; RK PN: RC0402JR-0710KL
R2138 = RESISTOR: НЁУГєсД¤µзЧи,10K,+/-5%,R0402,1/16W.; Part Reference: R2138; Manufacturer PN: RC0402JR-0710KL; Manufacturer: YAGEO; Wattage: 1/16W; Priority: A; PCB Footprint: R0402; Value: 10K; Created by: YTL; Part Type: НЁУГєсД¤µзЧи; RK PN: RC0402JR-0710KL
R2139 = RESISTOR_Dup1: єсД¤µНЧиЦµµзЧи,0R05,+/-1%,R0603,1/10W.; Part Reference: R2139; Manufacturer PN: RL0603FR-070R05L; Manufacturer: YAGEO; Value: 0.05R; Wattage: 1/10W; Priority: A; Created by: YTL; Part Type: єсД¤µНЧиЦµµзЧи; RK PN: RL0603FR-070R05L
R2140 = RESISTOR_Dup1: НЁУГєсД¤µзЧи,100K,+/-5%,R0402,1/16W.; Part Reference: R2140; Manufacturer: YAGEO; RK PN: RC0402JR-07100KL; Priority: A; Wattage: 1/16W; PCB Footprint: R0402; Value: 100K; Part Type: НЁУГєсД¤µзЧи; Manufacturer PN: RC0402JR-07100KL; Created by: YTL
R2141 = RESISTOR_Dup1: НЁУГєсД¤µзЧи,0R,+/-5%,R0603,1/10W.; Part Reference: R2141; Manufacturer PN: RC0603JR-070RL; Manufacturer: YAGEO; Wattage: 1/10W; Priority: A; Value: 0R; Created by: YTL; Part Type: НЁУГєсД¤µзЧи; RK PN: RC0603JR-070RL
R2142 = RESISTOR_Dup1: єсД¤µНЧиЦµµзЧи,0R02,+/-1%,R0603,1/10W.; Part Reference: R2142; Manufacturer PN: RL0603FR-070R022L; Manufacturer: YAGEO; Value: 0.02R; Wattage: 1/10W; Priority: A; Created by: YTL; Part Type: єсД¤µНЧиЦµµзЧи; RK PN: RL0603FR-070R022L
R2143 = RESISTOR_Dup1: єсД¤µНЧиЦµµзЧи,0R02,+/-1%,R0603,1/10W.; Part Reference: R2143; Manufacturer PN: RL0603FR-070R022L; Manufacturer: YAGEO; Value: 0.02R; Wattage: 1/10W; Priority: A; Created by: YTL; Part Type: єсД¤µНЧиЦµµзЧи; RK PN: RL0603FR-070R022L
R2144 = RESISTOR_Dup1: єсД¤µНЧиЦµµзЧи,0R05,+/-1%,R0603,1/10W.; Part Reference: R2144; Manufacturer PN: RL0603FR-070R05L; Manufacturer: YAGEO; Value: 0.05R; Wattage: 1/10W; Priority: A; Created by: YTL; Part Type: єсД¤µНЧиЦµµзЧи; RK PN: RL0603FR-070R05L
R2150 = RESISTOR: НЁУГєсД¤µзЧи,100K,+/-5%,R0402,1/16W.; Part Reference: R2150; Manufacturer PN: RC0402JR-07100KL; Manufacturer: YAGEO; Wattage: 1/16W; Priority: A; PCB Footprint: R0402; Value: 100K; Created by: YTL; Part Type: НЁУГєсД¤µзЧи; RK PN: RC0402JR-07100KL
U2100 = PMIC_RK806: ROCKCHIP PMIC RK806-1; Part Reference: U2100; Manufacturer: Rockchip (ИрРѕОў); Priority: A; Value: RK806-1; RK PN: RK806-1; Part Type: PMIC; Manufacturer PN: RK806-1; Created by: YWQ; PCB Footprint: QFN68_7R00X7R00X0R80_T